# Altium schematic sheet Legend.SchDoc
size A4; SheetNumber: 1; SheetTotal: 5
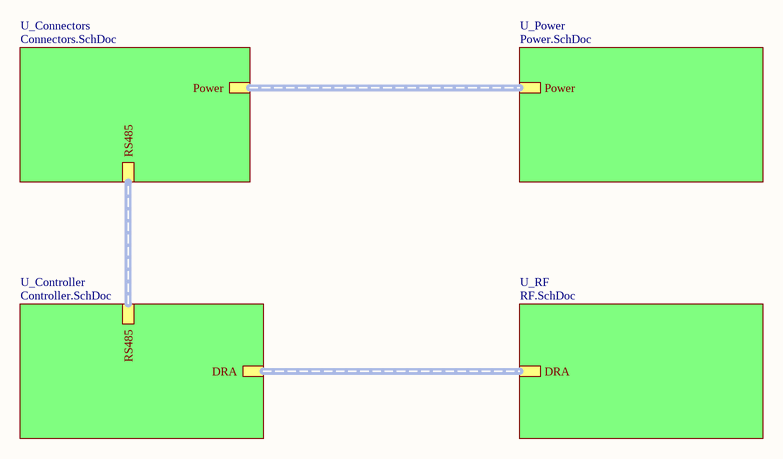
[diagram p0: Legend.SchDoc]

## Sub-sheets
U_Connectors = Connectors.SchDoc: RS485, Power
U_Controller = Controller.SchDoc: RS485, DRA
U_Power = Power.SchDoc: Power
U_RF = RF.SchDoc: DRA

## Buses and harness runs
harness sheet U_Connectors/Power = sheet U_Power/Power
harness sheet U_Connectors/RS485 = sheet U_Controller/RS485
harness sheet U_Controller/DRA = sheet U_RF/DRA